# EAGLE schematic simple-evse-esp32 (EAGLE 7.7.0)
Simple-EVSE-ESP32
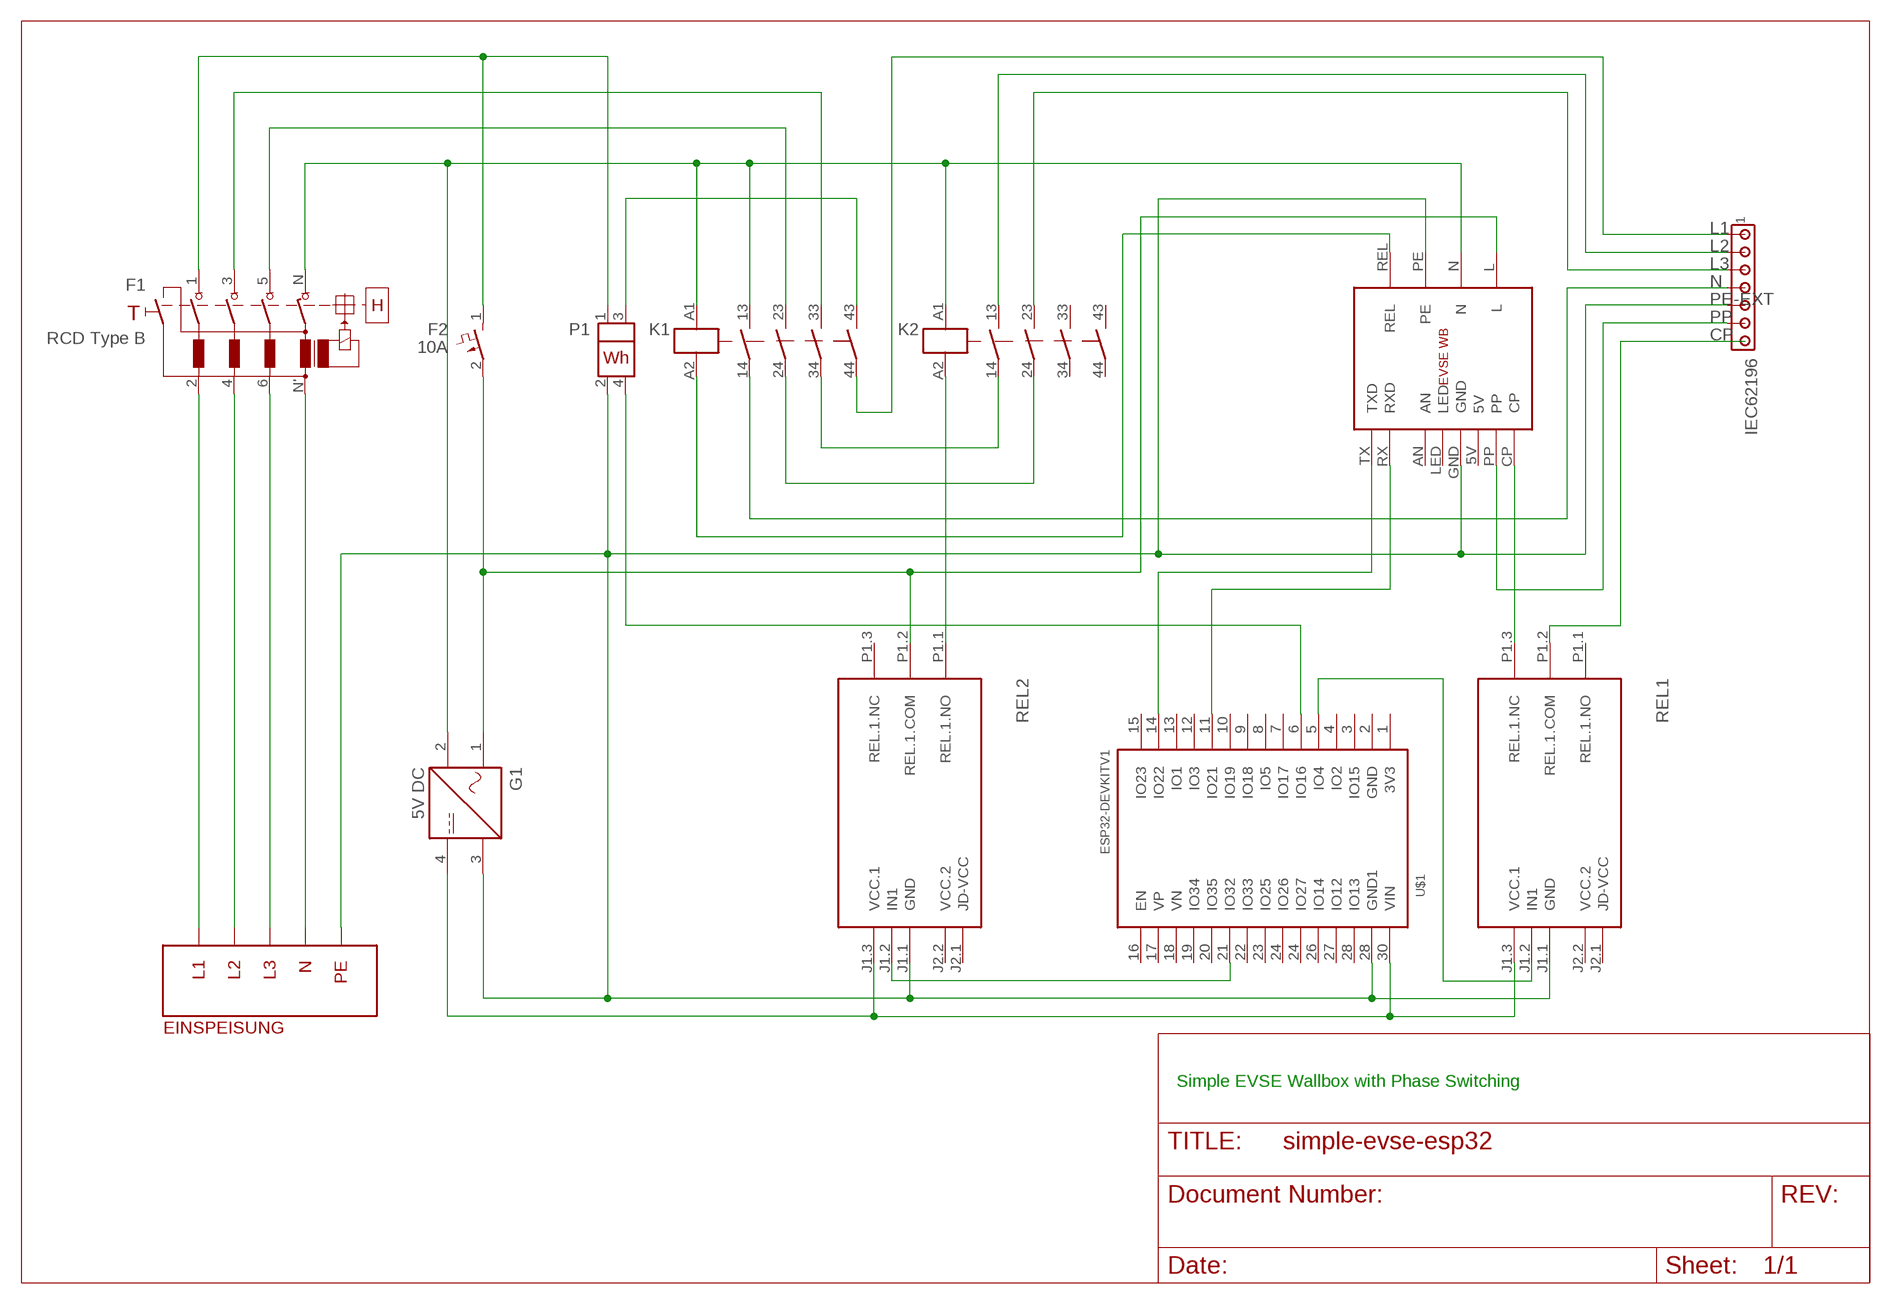
[diagram p0: schematic, sheet 1]

## Parts
F1  RCD Type B  FEHLER-STROM-SCHUTZSCHALTER_4-POL  [FEHLER-STROM-SCHUTZSCHALTER_4-POL]
F2  10A  LEITUNGSSCHUTZSCHALTER  [LEITUNGSSCHUTZSCHALTER]
G1  5V DC  NETZTEIL_GLEICHSPANNUNG  [NETZTEIL_GLEICHSPANNUNG]
IEC62196  MTA07-156  [1X7MTA]
K1  HILFSSCHUETZ_13-14_23_24_33-34_43-44_OHNE_KONTAKTSPIEGEL  [HILFSSCHUETZ_13-14_23_24_33-34_43-44_OHNE_KONTAKTSPIEGEL]
K2  HILFSSCHUETZ_13-14_23_24_33-34_43-44_OHNE_KONTAKTSPIEGEL  [HILFSSCHUETZ_13-14_23_24_33-34_43-44_OHNE_KONTAKTSPIEGEL]
P1  ENERGIEZAEHLER/WATTSTUNDENZAEHLER  [ENERGIEZAEHLER/WATTSTUNDENZAEHLER]
REL1  RELAY-1-SRD#RC  [RELAY-1-SRD#RC]
REL2  RELAY-1-SRD#RC  [RELAY-1-SRD#RC]
U$1  ESP32DEVKITV1  [ESP32-DEVKITV1]
U$5  EVSEWB  [EVSEWB]

## Nets
CP: IEC62196.7 REL1.P1.2(REL.1.COM)
L1: IEC62196.1 K1.44
L1-EXT: F1.2
L2: IEC62196.2 K2.13
L2-EXT: F1.4
L3: IEC62196.3 K2.23
L3-EXT: F1.6
N: IEC62196.4 K1.14
N$1: F1.N G1.2 K1.13 K1.A1 K2.A1 U$5.N
N$2: F1.1 F2.1 P1.1(I1)
N$3: F1.3 K1.33
N$4: F1.5 K1.23
N$5: K1.34 K2.14
N$6: K1.24 K2.24
N$7: K1.43 P1.3(U1)
N$8: REL1.J1.2(IN1) U$1.5(IO4)
N$10: F2.2 G1.1 REL2.P1.2(REL.1.COM) U$5.L
N$13: K1.A2 U$5.REL
N$14: G1.4 REL1.J1.3(VCC.1) REL2.J1.3(VCC.1) U$1.30(VIN)
N$17: REL2.J1.2(IN1) U$1.21(IO32)
N$18: K2.A2 REL2.P1.1(REL.1.NO)
N$19: REL1.P1.3(REL.1.NC) U$5.CP
N$20: U$1.11(IO21) U$5.RX(RXD)
N$21: U$1.14(IO22) U$5.TX(TXD)
N$23: P1.4(U2) U$1.6(IO16)
N-EXT: F1.N'
PE-EXT: G1.3 IEC62196.5 P1.2(I2) REL1.J1.1(GND) REL2.J1.1(GND) U$1.28(GND1) U$5.GND U$5.PE
PP: IEC62196.6 U$5.PP
Unconnected: K2.33 K2.34 K2.43 K2.44 REL1.J2.1(JD-VCC) REL1.P1.1(REL.1.NO) REL2.J2.1(JD-VCC) REL2.P1.3(REL.1.NC) U$1.1(3V3) U$1.2(GND) U$1.3(IO15) U$1.4(IO2) U$1.7(IO17) U$1.8(IO5) U$1.9(IO18) U$1.10(IO19) U$1.12(IO3) U$1.13(IO1) U$1.15(IO23) U$1.16(EN) U$1.17(VP) U$1.18(VN) U$1.19(IO34) U$1.20(IO35) U$1.22(IO33) U$1.23(IO25) U$1.24(IO26) U$1.24(IO27) U$1.26(IO14) U$1.27(IO12) U$1.28(IO13) U$5.5V U$5.AN U$5.LED

## Notes on the sheet
- Simple EVSE Wallbox with Phase Switching

## Power pins joined to a net without a drawn wire
VCC.2: REL1.J2.2(VCC.2) REL2.J2.2(VCC.2)

## Library data of the parts
F1 = e-sicherungen:FEHLER-STROM-SCHUTZSCHALTER_4-POL: Fehlerstromschutzschalter (FI) 4-pol mit Prüftaster
F2 = e-sicherungen:LEITUNGSSCHUTZSCHALTER: Sicherung
G1 = e-stromversorgungselemente:NETZTEIL_GLEICHSPANNUNG: Netzteil, Gleichspannung
IEC62196 = con-amp:MTA07-156: AMP connector
K1 K2 = e-schuetze-relais:HILFSSCHUETZ_13-14_23_24_33-34_43-44_OHNE_KONTAKTSPIEGEL: Hilfsschütz mit 4 Schließern ohne Kontaktspiegel
P1 = e-messinstrumente:ENERGIEZAEHLER/WATTSTUNDENZAEHLER: Energiezähler, Wattstundenzähler
REL1 REL2 = App Store:RELAY-1-SRD#RC: 1-Channel Relay Module based on SRD-05VDC-SL-C relays Symbol with relays pins Click here to find device on ebay.com <http://www.ebay.com/sch/one+channel+isolated+relay+5v>
U$1 = ESP32-DEVKITV1:ESP32DEVKITV1
U$5 = EVSEWB:EVSEWB